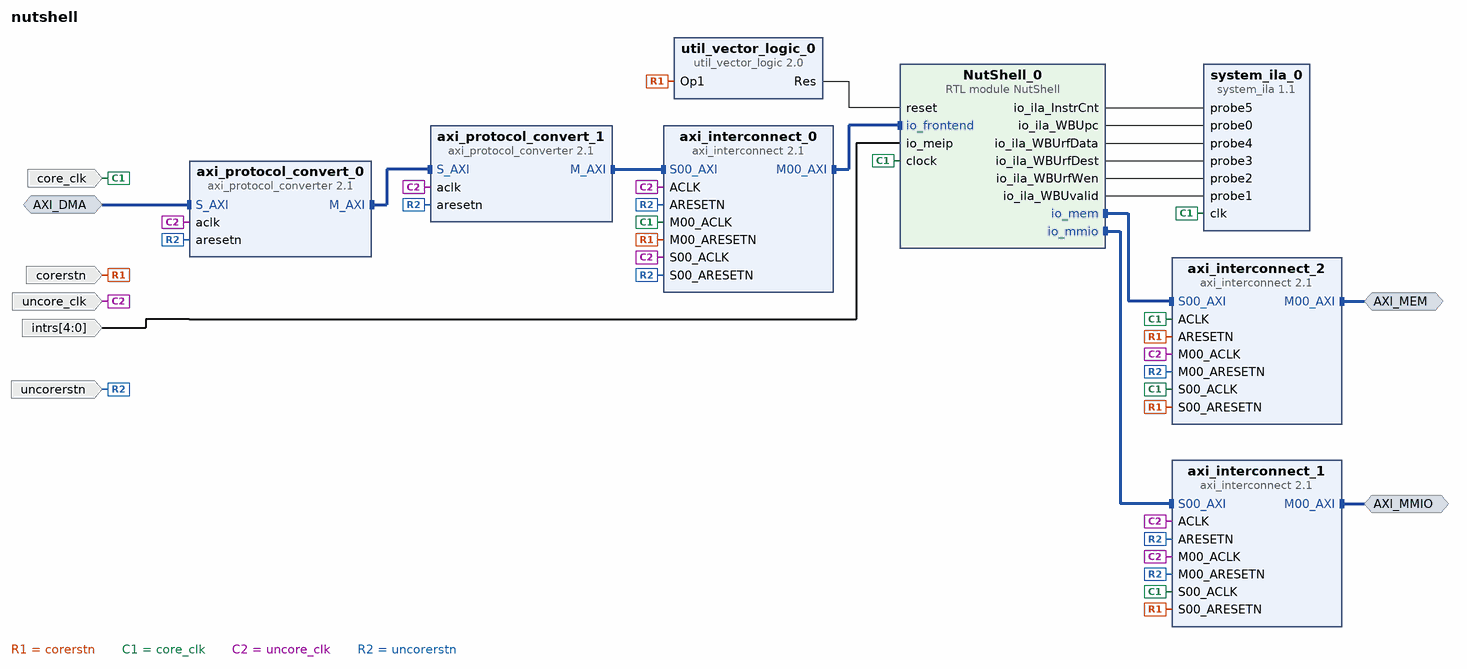
[diagram p0: block diagram of the top level]
# Vivado block design nutshell, xczu19eg-ffvc1760-2-i, Vivado 2023.2
create_bd_design nutshell

create_bd_intf_port -mode Slave -vlnv xilinx.com:interface:aximm_rtl:1.0 AXI_DMA
set_property -dict [list \
  CONFIG.ADDR_WIDTH 32 \
  CONFIG.ARUSER_WIDTH 0 \
  CONFIG.AWUSER_WIDTH 0 \
  CONFIG.BUSER_WIDTH 0 \
  CONFIG.CLK_DOMAIN /clk_wiz_0_clk_out1 \
  CONFIG.DATA_WIDTH 64 \
  CONFIG.HAS_BRESP 1 \
  CONFIG.HAS_BURST 1 \
  CONFIG.HAS_CACHE 1 \
  CONFIG.HAS_LOCK 1 \
  CONFIG.HAS_PROT 1 \
  CONFIG.HAS_QOS 1 \
  CONFIG.HAS_REGION 1 \
  CONFIG.HAS_RRESP 1 \
  CONFIG.HAS_WSTRB 1 \
  CONFIG.ID_WIDTH 16 \
  CONFIG.MAX_BURST_LENGTH 256 \
  CONFIG.NUM_READ_OUTSTANDING 2 \
  CONFIG.NUM_READ_THREADS 1 \
  CONFIG.NUM_WRITE_OUTSTANDING 2 \
  CONFIG.NUM_WRITE_THREADS 1 \
  CONFIG.PHASE 0.0 \
  CONFIG.PROTOCOL AXI4 \
  CONFIG.READ_WRITE_MODE READ_WRITE \
  CONFIG.RUSER_BITS_PER_BYTE 0 \
  CONFIG.RUSER_WIDTH 0 \
  CONFIG.SUPPORTS_NARROW_BURST 1 \
  CONFIG.WUSER_BITS_PER_BYTE 0 \
  CONFIG.WUSER_WIDTH 0 \
] [get_bd_intf_ports AXI_DMA]
create_bd_intf_port -mode Master -vlnv xilinx.com:interface:aximm_rtl:1.0 AXI_MEM
set_property -dict [list \
  CONFIG.ADDR_WIDTH 32 \
  CONFIG.CLK_DOMAIN /clk_wiz_0_clk_out1 \
  CONFIG.DATA_WIDTH 64 \
  CONFIG.NUM_READ_OUTSTANDING 2 \
  CONFIG.NUM_WRITE_OUTSTANDING 2 \
  CONFIG.PHASE 0.0 \
  CONFIG.PROTOCOL AXI4 \
] [get_bd_intf_ports AXI_MEM]
create_bd_intf_port -mode Master -vlnv xilinx.com:interface:aximm_rtl:1.0 AXI_MMIO
set_property -dict [list \
  CONFIG.ADDR_WIDTH 32 \
  CONFIG.CLK_DOMAIN /clk_wiz_0_clk_out1 \
  CONFIG.DATA_WIDTH 64 \
  CONFIG.NUM_READ_OUTSTANDING 2 \
  CONFIG.NUM_WRITE_OUTSTANDING 2 \
  CONFIG.PHASE 0.0 \
  CONFIG.PROTOCOL AXI4 \
] [get_bd_intf_ports AXI_MMIO]
create_bd_port -dir I -type clk core_clk
set_property -dict {CONFIG.ASSOCIATED_RESET corerstn CONFIG.FREQ_HZ 100000000} [get_bd_ports core_clk]
create_bd_port -dir I -type data corerstn
create_bd_port -dir I -from 4 -to 0 intrs
create_bd_port -dir I -type clk uncore_clk
set_property -dict [list \
  CONFIG.ASSOCIATED_RESET uncorerstn \
  CONFIG.CLK_DOMAIN /clk_wiz_0_clk_out1 \
  CONFIG.FREQ_HZ 100000000 \
  CONFIG.PHASE 0.0 \
] [get_bd_ports uncore_clk]
create_bd_port -dir I -type rst uncorerstn

create_bd_cell -type module -reference NutShell NutShell_0
create_bd_cell -type ip -vlnv xilinx.com:ip:axi_interconnect:2.1 axi_interconnect_0
set_property -dict {CONFIG.NUM_MI 1} [get_bd_cells axi_interconnect_0]
create_bd_cell -type ip -vlnv xilinx.com:ip:axi_interconnect:2.1 axi_interconnect_1
set_property -dict {CONFIG.NUM_MI 1 CONFIG.NUM_SI 1} [get_bd_cells axi_interconnect_1]
create_bd_cell -type ip -vlnv xilinx.com:ip:axi_interconnect:2.1 axi_interconnect_2
set_property -dict {CONFIG.NUM_MI 1 CONFIG.NUM_SI 1} [get_bd_cells axi_interconnect_2]
create_bd_cell -type ip -vlnv xilinx.com:ip:axi_protocol_converter:2.1 axi_protocol_convert_0
set_property -dict {CONFIG.MI_PROTOCOL AXI4LITE CONFIG.SI_PROTOCOL AXI4} [get_bd_cells axi_protocol_convert_0]
create_bd_cell -type ip -vlnv xilinx.com:ip:axi_protocol_converter:2.1 axi_protocol_convert_1
create_bd_cell -type ip -vlnv xilinx.com:ip:system_ila:1.1 system_ila_0
set_property -dict {CONFIG.C_MON_TYPE NATIVE CONFIG.C_NUM_MONITOR_SLOTS 1 CONFIG.C_NUM_OF_PROBES 6} [get_bd_cells system_ila_0]
create_bd_cell -type ip -vlnv xilinx.com:ip:util_vector_logic:2.0 util_vector_logic_0
set_property -dict {CONFIG.C_OPERATION not CONFIG.C_SIZE 1} [get_bd_cells util_vector_logic_0]

# ---- connections ----

connect_bd_intf_net -intf_net M_AXI_DMA_1 [get_bd_intf_ports AXI_DMA] [get_bd_intf_pins axi_protocol_convert_0/S_AXI]
connect_bd_intf_net [get_bd_intf_pins NutShell_0/io_mem] [get_bd_intf_pins axi_interconnect_2/S00_AXI]
connect_bd_intf_net [get_bd_intf_pins NutShell_0/io_mmio] [get_bd_intf_pins axi_interconnect_1/S00_AXI]
connect_bd_intf_net [get_bd_intf_pins axi_interconnect_0/S00_AXI] [get_bd_intf_pins axi_protocol_convert_1/M_AXI]
connect_bd_intf_net -intf_net axi_clock_converter_0_M_AXI [get_bd_intf_ports AXI_MEM] [get_bd_intf_pins axi_interconnect_2/M00_AXI]
connect_bd_intf_net [get_bd_intf_pins NutShell_0/io_frontend] [get_bd_intf_pins axi_interconnect_0/M00_AXI]
connect_bd_intf_net [get_bd_intf_ports AXI_MMIO] [get_bd_intf_pins axi_interconnect_1/M00_AXI]
connect_bd_intf_net [get_bd_intf_pins axi_protocol_convert_0/M_AXI] [get_bd_intf_pins axi_protocol_convert_1/S_AXI]
connect_bd_net [get_bd_pins NutShell_0/io_ila_InstrCnt] [get_bd_pins system_ila_0/probe5]
connect_bd_net [get_bd_pins NutShell_0/io_ila_WBUpc] [get_bd_pins system_ila_0/probe0]
connect_bd_net [get_bd_pins NutShell_0/io_ila_WBUrfData] [get_bd_pins system_ila_0/probe4]
connect_bd_net [get_bd_pins NutShell_0/io_ila_WBUrfDest] [get_bd_pins system_ila_0/probe3]
connect_bd_net [get_bd_pins NutShell_0/io_ila_WBUrfWen] [get_bd_pins system_ila_0/probe2]
connect_bd_net [get_bd_pins NutShell_0/io_ila_WBUvalid] [get_bd_pins system_ila_0/probe1]
connect_bd_net -net c_shift_ram_0_Q [get_bd_ports corerstn] \
  [get_bd_pins axi_interconnect_0/M00_ARESETN] [get_bd_pins axi_interconnect_1/S00_ARESETN] \
  [get_bd_pins axi_interconnect_2/ARESETN] [get_bd_pins axi_interconnect_2/S00_ARESETN] [get_bd_pins util_vector_logic_0/Op1]
connect_bd_net [get_bd_ports core_clk] \
  [get_bd_pins NutShell_0/clock] [get_bd_pins axi_interconnect_0/M00_ACLK] [get_bd_pins axi_interconnect_1/S00_ACLK] \
  [get_bd_pins axi_interconnect_2/ACLK] [get_bd_pins axi_interconnect_2/S00_ACLK] [get_bd_pins system_ila_0/clk]
connect_bd_net [get_bd_ports intrs] [get_bd_pins NutShell_0/io_meip]
connect_bd_net [get_bd_ports uncore_clk] \
  [get_bd_pins axi_interconnect_0/ACLK] [get_bd_pins axi_interconnect_0/S00_ACLK] [get_bd_pins axi_interconnect_1/ACLK] \
  [get_bd_pins axi_interconnect_1/M00_ACLK] [get_bd_pins axi_interconnect_2/M00_ACLK] \
  [get_bd_pins axi_protocol_convert_0/aclk] [get_bd_pins axi_protocol_convert_1/aclk]
connect_bd_net [get_bd_ports uncorerstn] \
  [get_bd_pins axi_interconnect_0/ARESETN] [get_bd_pins axi_interconnect_0/S00_ARESETN] \
  [get_bd_pins axi_interconnect_1/ARESETN] [get_bd_pins axi_interconnect_1/M00_ARESETN] \
  [get_bd_pins axi_interconnect_2/M00_ARESETN] [get_bd_pins axi_protocol_convert_0/aresetn] \
  [get_bd_pins axi_protocol_convert_1/aresetn]
connect_bd_net [get_bd_pins util_vector_logic_0/Res] [get_bd_pins NutShell_0/reset]

# ---- address map ----
assign_bd_address -offset 0x00000000 -range 4G -target_address_space [get_bd_addr_spaces AXI_DMA] [get_bd_addr_segs NutShell_0/io_frontend/reg0]
assign_bd_address -offset 0x80000000 -range 2G -target_address_space [get_bd_addr_spaces NutShell_0/io_mem] [get_bd_addr_segs AXI_MEM/Reg]
assign_bd_address -offset 0x40000000 -range 1G -target_address_space [get_bd_addr_spaces NutShell_0/io_mmio] [get_bd_addr_segs AXI_MMIO/Reg]

validate_bd_design
save_bd_design
